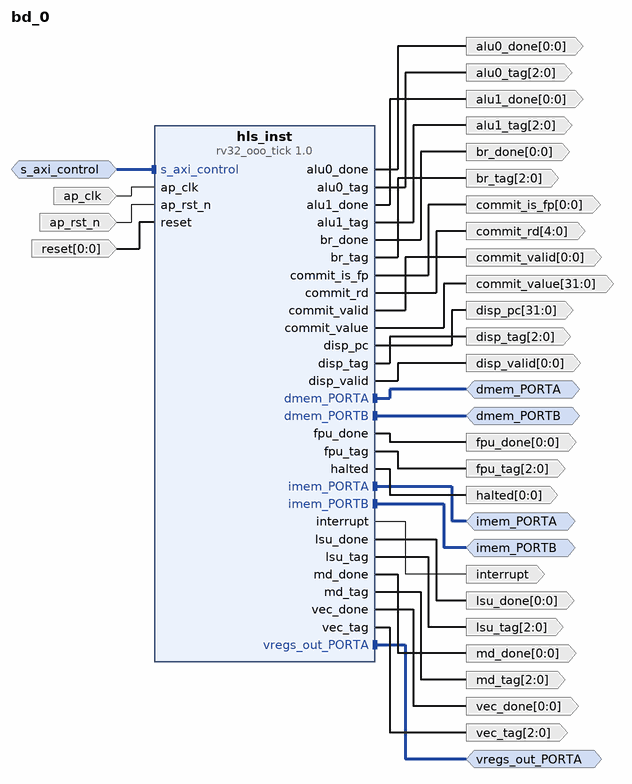
[diagram p0: block diagram of the top level]
# Vivado block design bd_0, xck26-sfvc784-2LV-c, Vivado 2024.2
create_bd_design bd_0

create_bd_intf_port -mode Master -vlnv xilinx.com:interface:bram_rtl:1.0 dmem_PORTA
set_property -dict {CONFIG.MASTER_TYPE BRAM_CTRL} [get_bd_intf_ports dmem_PORTA]
create_bd_intf_port -mode Master -vlnv xilinx.com:interface:bram_rtl:1.0 dmem_PORTB
set_property -dict {CONFIG.MASTER_TYPE BRAM_CTRL} [get_bd_intf_ports dmem_PORTB]
create_bd_intf_port -mode Master -vlnv xilinx.com:interface:bram_rtl:1.0 imem_PORTA
set_property -dict {CONFIG.MASTER_TYPE BRAM_CTRL} [get_bd_intf_ports imem_PORTA]
create_bd_intf_port -mode Master -vlnv xilinx.com:interface:bram_rtl:1.0 imem_PORTB
set_property -dict {CONFIG.MASTER_TYPE BRAM_CTRL} [get_bd_intf_ports imem_PORTB]
create_bd_intf_port -mode Slave -vlnv xilinx.com:interface:aximm_rtl:1.0 s_axi_control
set_property -dict [list \
  CONFIG.ADDR_WIDTH 32 \
  CONFIG.ARUSER_WIDTH 0 \
  CONFIG.AWUSER_WIDTH 0 \
  CONFIG.BUSER_WIDTH 0 \
  CONFIG.DATA_WIDTH 32 \
  CONFIG.FREQ_HZ 100000000.0 \
  CONFIG.HAS_BRESP 1 \
  CONFIG.HAS_BURST 0 \
  CONFIG.HAS_CACHE 0 \
  CONFIG.HAS_LOCK 0 \
  CONFIG.HAS_PROT 0 \
  CONFIG.HAS_QOS 0 \
  CONFIG.HAS_REGION 0 \
  CONFIG.HAS_RRESP 1 \
  CONFIG.HAS_WSTRB 1 \
  CONFIG.ID_WIDTH 0 \
  CONFIG.NUM_READ_OUTSTANDING 1 \
  CONFIG.NUM_READ_THREADS 1 \
  CONFIG.NUM_WRITE_OUTSTANDING 1 \
  CONFIG.NUM_WRITE_THREADS 1 \
  CONFIG.PROTOCOL AXI4LITE \
  CONFIG.READ_WRITE_MODE READ_WRITE \
  CONFIG.RUSER_BITS_PER_BYTE 0 \
  CONFIG.RUSER_WIDTH 0 \
  CONFIG.WUSER_BITS_PER_BYTE 0 \
  CONFIG.WUSER_WIDTH 0 \
] [get_bd_intf_ports s_axi_control]
create_bd_intf_port -mode Master -vlnv xilinx.com:interface:bram_rtl:1.0 vregs_out_PORTA
set_property -dict {CONFIG.MASTER_TYPE BRAM_CTRL} [get_bd_intf_ports vregs_out_PORTA]
create_bd_port -dir O -from 0 -to 0 -type data alu0_done
create_bd_port -dir O -from 2 -to 0 -type data alu0_tag
create_bd_port -dir O -from 0 -to 0 -type data alu1_done
create_bd_port -dir O -from 2 -to 0 -type data alu1_tag
create_bd_port -dir I -type clk ap_clk
set_property -dict {CONFIG.FREQ_HZ 100000000.0} [get_bd_ports ap_clk]
create_bd_port -dir I -type rst ap_rst_n
create_bd_port -dir O -from 0 -to 0 -type data br_done
create_bd_port -dir O -from 2 -to 0 -type data br_tag
create_bd_port -dir O -from 0 -to 0 -type data commit_is_fp
create_bd_port -dir O -from 4 -to 0 -type data commit_rd
create_bd_port -dir O -from 0 -to 0 -type data commit_valid
create_bd_port -dir O -from 31 -to 0 -type data commit_value
create_bd_port -dir O -from 31 -to 0 -type data disp_pc
create_bd_port -dir O -from 2 -to 0 -type data disp_tag
create_bd_port -dir O -from 0 -to 0 -type data disp_valid
create_bd_port -dir O -from 0 -to 0 -type data fpu_done
create_bd_port -dir O -from 2 -to 0 -type data fpu_tag
create_bd_port -dir O -from 0 -to 0 -type data halted
create_bd_port -dir O -type intr interrupt
create_bd_port -dir O -from 0 -to 0 -type data lsu_done
create_bd_port -dir O -from 2 -to 0 -type data lsu_tag
create_bd_port -dir O -from 0 -to 0 -type data md_done
create_bd_port -dir O -from 2 -to 0 -type data md_tag
create_bd_port -dir I -from 0 -to 0 -type data reset
create_bd_port -dir O -from 0 -to 0 -type data vec_done
create_bd_port -dir O -from 2 -to 0 -type data vec_tag

create_bd_cell -type ip -vlnv xilinx.com:hls:rv32_ooo_tick:1.0 hls_inst

# ---- connections ----

connect_bd_intf_net [get_bd_intf_ports dmem_PORTA] [get_bd_intf_pins hls_inst/dmem_PORTA]
connect_bd_intf_net [get_bd_intf_ports dmem_PORTB] [get_bd_intf_pins hls_inst/dmem_PORTB]
connect_bd_intf_net [get_bd_intf_ports imem_PORTA] [get_bd_intf_pins hls_inst/imem_PORTA]
connect_bd_intf_net [get_bd_intf_ports imem_PORTB] [get_bd_intf_pins hls_inst/imem_PORTB]
connect_bd_intf_net [get_bd_intf_ports vregs_out_PORTA] [get_bd_intf_pins hls_inst/vregs_out_PORTA]
connect_bd_intf_net -intf_net s_axi_control_0_1 [get_bd_intf_ports s_axi_control] [get_bd_intf_pins hls_inst/s_axi_control]
connect_bd_net -net ap_clk_0_1 [get_bd_ports ap_clk] [get_bd_pins hls_inst/ap_clk]
connect_bd_net -net ap_rst_n_0_1 [get_bd_ports ap_rst_n] [get_bd_pins hls_inst/ap_rst_n]
connect_bd_net [get_bd_pins hls_inst/alu0_done] [get_bd_ports alu0_done]
connect_bd_net [get_bd_pins hls_inst/alu0_tag] [get_bd_ports alu0_tag]
connect_bd_net [get_bd_pins hls_inst/alu1_done] [get_bd_ports alu1_done]
connect_bd_net [get_bd_pins hls_inst/alu1_tag] [get_bd_ports alu1_tag]
connect_bd_net [get_bd_pins hls_inst/br_done] [get_bd_ports br_done]
connect_bd_net [get_bd_pins hls_inst/br_tag] [get_bd_ports br_tag]
connect_bd_net [get_bd_pins hls_inst/commit_is_fp] [get_bd_ports commit_is_fp]
connect_bd_net [get_bd_pins hls_inst/commit_rd] [get_bd_ports commit_rd]
connect_bd_net [get_bd_pins hls_inst/commit_valid] [get_bd_ports commit_valid]
connect_bd_net [get_bd_pins hls_inst/commit_value] [get_bd_ports commit_value]
connect_bd_net [get_bd_pins hls_inst/disp_pc] [get_bd_ports disp_pc]
connect_bd_net [get_bd_pins hls_inst/disp_tag] [get_bd_ports disp_tag]
connect_bd_net [get_bd_pins hls_inst/disp_valid] [get_bd_ports disp_valid]
connect_bd_net [get_bd_pins hls_inst/fpu_done] [get_bd_ports fpu_done]
connect_bd_net [get_bd_pins hls_inst/fpu_tag] [get_bd_ports fpu_tag]
connect_bd_net [get_bd_pins hls_inst/halted] [get_bd_ports halted]
connect_bd_net [get_bd_pins hls_inst/interrupt] [get_bd_ports interrupt]
connect_bd_net [get_bd_pins hls_inst/lsu_done] [get_bd_ports lsu_done]
connect_bd_net [get_bd_pins hls_inst/lsu_tag] [get_bd_ports lsu_tag]
connect_bd_net [get_bd_pins hls_inst/md_done] [get_bd_ports md_done]
connect_bd_net [get_bd_pins hls_inst/md_tag] [get_bd_ports md_tag]
connect_bd_net [get_bd_pins hls_inst/vec_done] [get_bd_ports vec_done]
connect_bd_net [get_bd_pins hls_inst/vec_tag] [get_bd_ports vec_tag]
connect_bd_net -net reset_0_1 [get_bd_ports reset] [get_bd_pins hls_inst/reset]

# ---- address map ----
assign_bd_address -offset 0x00000000 -range 64K -target_address_space [get_bd_addr_spaces s_axi_control] [get_bd_addr_segs hls_inst/s_axi_control/Reg]

validate_bd_design
save_bd_design
